# EAGLE design MED_ESP32_C3_0002 (EAGLE 6.5.0)
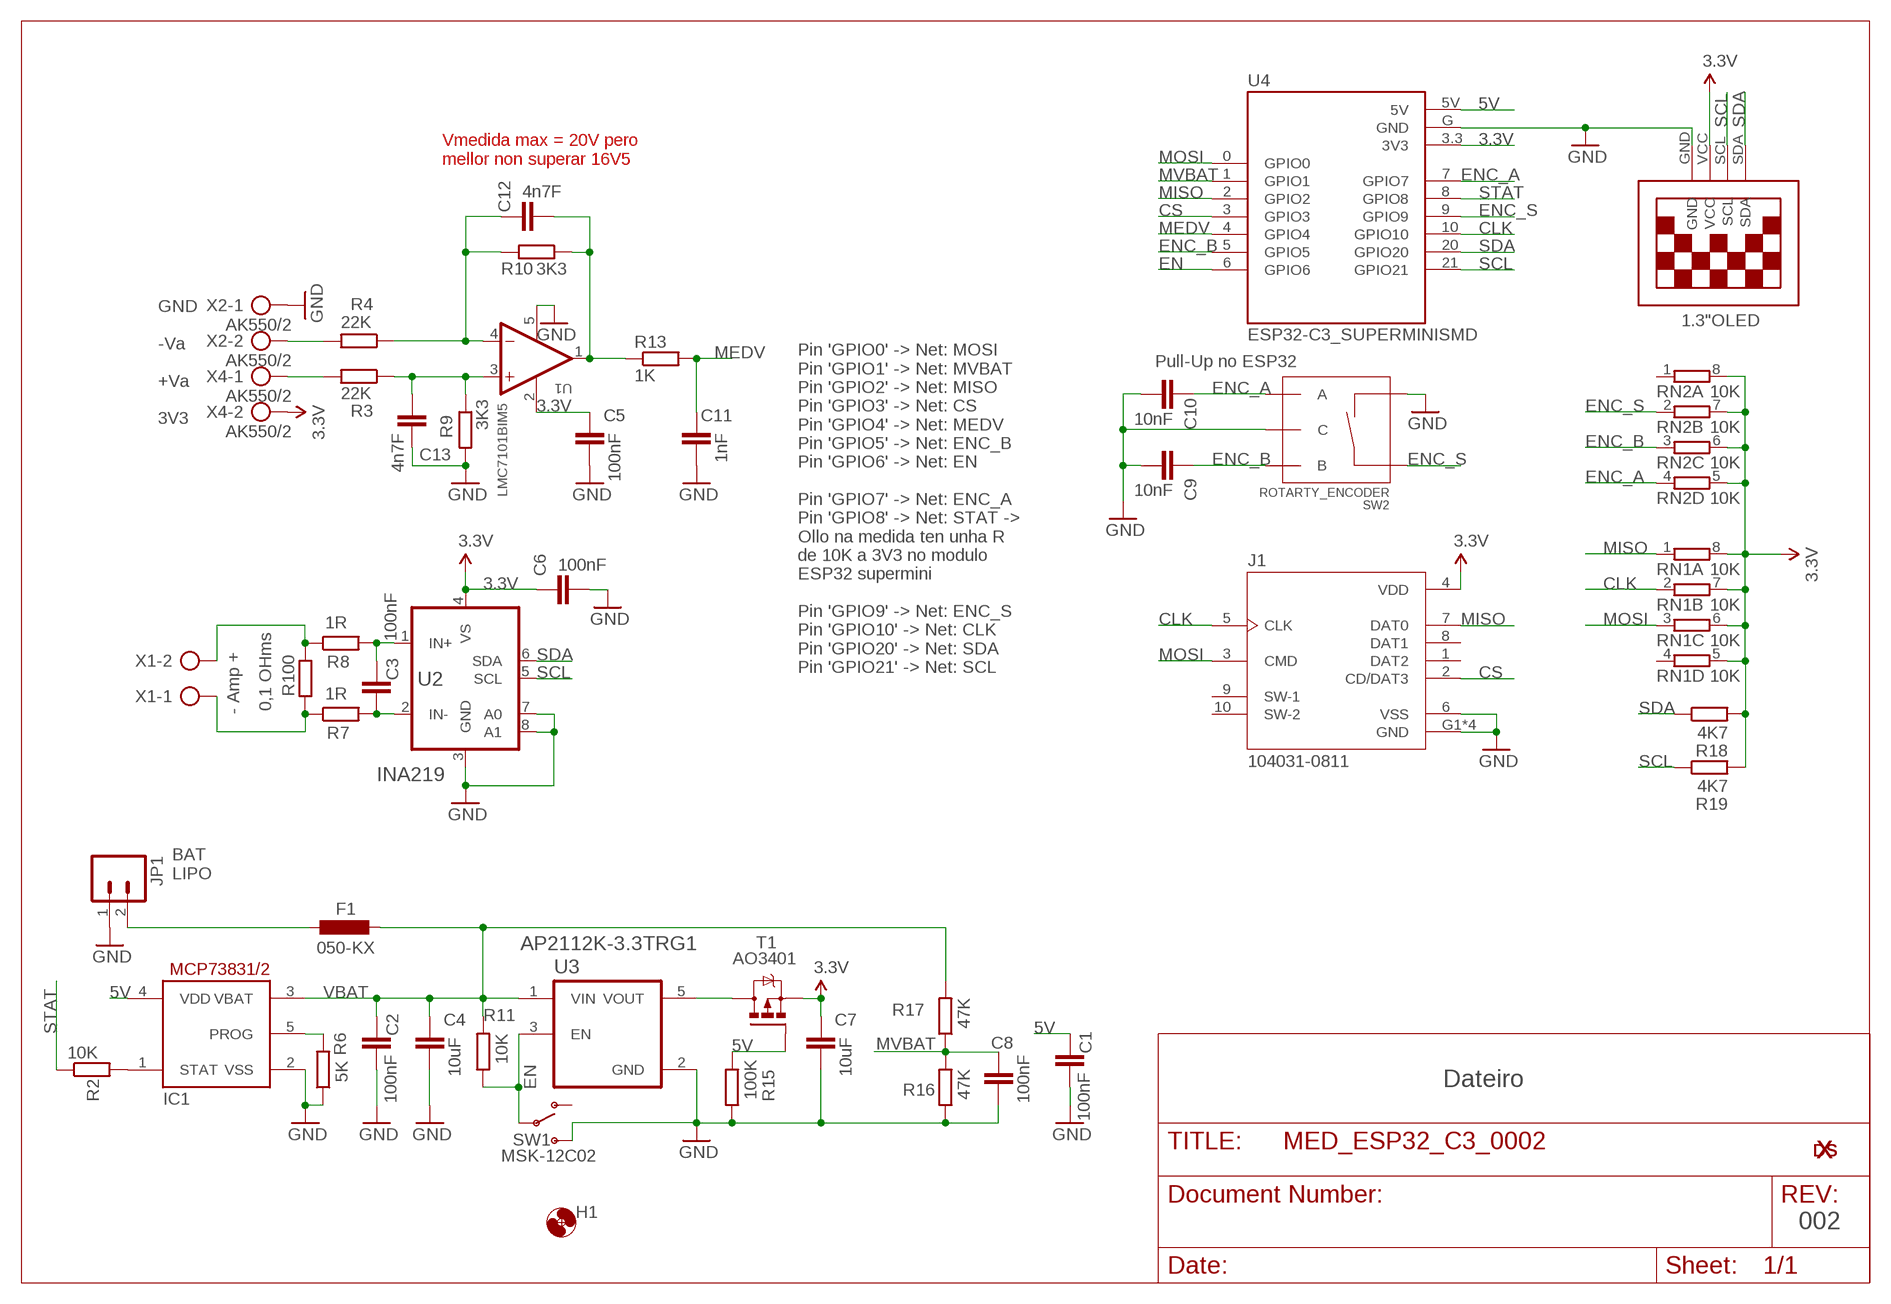
[diagram p0: schematic, sheet 1]

## Parts
C1  100nF  C-EUC0603  [C0603]
C2  100nF  C-EUC0603  [C0603]
C3  100nF  C-EUC0603  [C0603]
C4  10uF  C-EUC1206  [C1206]
C5  100nF  C-EUC0603  [C0603]
C6  100nF  C-EUC0603  [C0603]
C7  10uF  C-EUC1206  [C1206]
C8  100nF  C-EUC0603  [C0603]
C9  10nF  C-EUC0603  [C0603]
C10  10nF  C-EUC0603  [C0603]
C11  1nF  C-EUC0603  [C0603]
C12  4n7F  C-EUC0603  [C0603]
C13  4n7F  C-EUC0603  [C0603]
F1  050-KX  L-EUL3225M  [L3225M]
H1  HOLES_MOUNT-HOLE3.2  [HOLES_3,2]
IC1  MCP73831T-2  MCP73831/OT  [SOT23-5L]
J1  104031-0811  [MOLEX_104031-0811]
JP1  M02JST-PTH-VERT  [JST-2-PTH-VERT]
R2  10K  R-EU_R0603  [R0603]
R3  22K  R-EU_R0603  [R0603]
R4  22K  R-EU_R0603  [R0603]
R5  R100  R-EU_R1210  [R1210]
R6  5K  R-EU_R0603  [R0603]
R7  1R  R-EU_R0603  [R0603]
R8  1R  R-EU_R0603  [R0603]
R9  3K3  R-EU_R0603  [R0603]
R10  3K3  R-EU_R0603  [R0603]
R11  10K  R-EU_R0603  [R0603]
R13  1K  R-EU_R0603  [R0603]
R15  100K  R-EU_R0603  [R0603]
R16  47K  R-EU_R0603  [R0603]
R17  47K  R-EU_R0603  [R0603]
R18  4K7  R-EU_R0603  [R0603]
R19  4K7  R-EU_R0603  [R0603]
RN1  10K  RESISTOR-DIL_4R-N0603-ARC  [RESISTOR-DIL_0603-ARC]
RN2  10K  RESISTOR-DIL_4R-N0603-ARV  [RESISTOR-DIL_0603-ARV]
SW1  MSK-12C02  SWITCH_SPDT  [KPS-1290]
SW2  ROTARTY_ENCODER  [ROTARY_ENC_PLAIN]
T1  AO3401  MOSFET-PCHANNEL  [SOT23]
U1  LMC7101BIM5  [SOT95P280X145-5N]
U2  INA219  [SOT65P280X145-8N]
U3  AP2112K-3.3TRG1  [SOT95P285X140-5N]
U4  ESP32-C3_SUPERMINISMD  [MODULE_ESP-C3_SUPERMINI_SMD]
U$1  13"OLED13"OLED  [1.3"OLED]
U$2  XDESIG5MM  [XDESIG_CU]
U$3  XDESIG21  [XDESIG]
U$4  XDESIG21  [XDESIG]
U$5  XDESIG5MM  [XDESIG_CU]
X1  AK500/2  [AK500/2]
X2  AK550/2  [AK550/2]
X4  AK550/2  [AK550/2]

## Nets
3.3V: C5.2 C6.2 C7.2 J1.4(VDD) R18.2 R19.2 RN1.5 RN1.6 RN1.7 RN1.8 RN2.5 RN2.6 RN2.7 RN2.8 T1.2(S) U1.2(V+) U2.4(VS) U4.3.3(3V3) U$1.VCC X4.2
5V: C1.1 IC1.4(VDD) R15.2 T1.1(G) U4.5V
CLK: J1.5(CLK) RN1.2 U4.10(GPIO10)
CS: J1.2(CD/DAT3) U4.3(GPIO3)
EN: R11.1 SW1.P U3.3(EN) U4.6(GPIO6)
ENC_A: C10.2 RN2.4 SW2.A U4.7(GPIO7)
ENC_B: C9.2 RN2.3 SW2.B U4.5(GPIO5)
ENC_S: RN2.2 SW2.SW+ U4.9(GPIO9)
GND: C1.2 C2.2 C4.1 C5.1 C6.1 C7.1 C8.2 C9.1 C10.1 C11.1 C13.2 IC1.2(VSS) J1.6(VSS) J1.G1(GND) J1.G2(GND) J1.G3(GND) J1.G4(GND) JP1.1 R6.1 R9.2 R15.1 R16.1 SW1.S SW2.C SW2.SW- U1.5(V-) U2.3(GND) U2.7(A0) U2.8(A1) U3.2(GND) U4.G(GND) U$1.GND X2.1
MEDV: C11.2 R13.2 U4.4(GPIO4)
MISO: J1.7(DAT0) RN1.1 U4.2(GPIO2)
MOSI: J1.3(CMD) RN1.3 U4.0(GPIO0)
MVBAT: C8.1 R16.2 R17.1 U4.1(GPIO1)
N$1: R4.2 X2.2
N$2: T1.3(D) U3.5(VOUT)
N$4: C12.2 R4.1 R10.2 U1.4(-IN)
N$5: R3.2 X4.1
N$6: IC1.1(STAT) R2.2
N$7: IC1.5(PROG) R6.2
N$8: C12.1 R10.1 R13.1 U1.1(OUT)
N$9: F1.2 JP1.2
N$29: C13.1 R3.1 R9.1 U1.3(+IN)
N$81: C3.1 R8.2 U2.1(IN+)
N$96: C3.2 R7.2 U2.2(IN-)
N$103: R5.2 R8.1 X1.2
N$105: R5.1 R7.1 X1.1
SCL: R19.1 U2.5(SCL) U4.21(GPIO21) U$1.SCL
SDA: R18.1 U2.6(SDA) U4.20(GPIO20) U$1.SDA
STAT: R2.1 U4.8(GPIO8)
VBAT: C2.1 C4.2 F1.1 IC1.3(VBAT) R11.2 R17.2 U3.1(VIN)
Unconnected: J1.1(DAT2) J1.8(DAT1) J1.9(SW-1) J1.10(SW-2) RN1.4 RN2.1 SW1.O

## Notes on the sheet
- Vmedida max = 20V pero 
  mellor non superar 16V5
- 1.3"OLED
- Pull-Up no ESP32
- GND
  
  -Va
  
  +Va
  
  3V3
- 0,1 OHms
- - Amp +
- Pin 'GPIO0' -> Net: MOSI
  Pin 'GPIO1' -> Net: MVBAT
  Pin 'GPIO2' -> Net: MISO
  Pin 'GPIO3' -> Net: CS
  Pin 'GPIO4' -> Net: MEDV 
  Pin 'GPIO5' -> Net: ENC_B
  Pin 'GPIO6' -> Net: EN 
  
  Pin 'GPIO7' -> Net: ENC_A
  Pin 'GPIO8' -> Net: STAT -> 
  Ollo na medida ten unha R
  de 10K a 3V3 no modulo
  ESP32 supermini
  
  Pin 'GPIO9' -> Net: ENC_S
  Pin 'GPIO10' -> Net: CLK
  Pin 'GPIO20' -> Net: SDA
  Pin 'GPIO21' -> Net: SCL
- BAT
  LIPO
- Dateiro
- 002

## Library data of the parts
C1-C13 = rcl:C-EU: CAPACITOR, European symbol
F1 = rcl:L-EU: INDUCTOR, European symbol
H1 = escorna_LBREscorna_CPU_2_10:HOLES_MOUNT-HOLE: MOUNTING HOLE with drill center marker
IC1 = adafruit:MCP73831: MCP73831/2 Miniature Single-Cell, Fully Integrated Li-Ion, Li-Polymer Charge Management Controllers. Nice and small simple lipoly charge controller, with adjustable current and status output (LED) http://www.ladyada.net/library/pcb/eaglelibrary.html
J1 = 104031-0811:104031-0811: Check availability <https://pricing.snapeda.com/parts/104031-0811/Molex/view-part?ref=eda>; AVAILABILITY: In Stock; CHECK_PRICES: https://www.snapeda.com/parts/104031-0811/Molex/view-part/?ref=eda; DESCRIPTION: Surface Mount Micro SD Card Connector, with Push In Termination | Molex Incorporated 104031-0811; MF: Molex; MP: 104031-0811; PACKAGE: None; PRICE: None; PURCHASE-URL: https://www.snapeda.com/api/url_track_click_mouser/?unipart_id=301764&manufacturer=Molex&part_name=104031-0811&search_term=1040310811; SNAPEDA_LINK: https://www.snapeda.com/parts/104031-0811/Molex/view-part/?ref=snap
JP1 = SparkFun-Connectors:M02: Standard 2-pin 0.1" header. Use with - straight break away headers ( PRT-00116) - right angle break away headers (PRT-00553) - swiss pins (PRT-00743) - machine pins (PRT-00117) - female headers (PRT-00115) Molex polarized connector foot print use with: PRT-08233 with associated crimp pins and housings. 2.54_SCREWTERM for use with PRT-10571. 3.5mm Screw Terminal footprints for PRT-08084 5mm Screw Terminal footprints for use with PRT-08432
R2-R11 R13 R15-R19 = rcl:R-EU_: RESISTOR, European symbol
RN1 RN2 = cervus2.100:RESISTOR-DIL_4R-N: Array Chip Resistor Source: RS Component / Phycomp
SW1 = SparkFun-Electromechanical:SWITCH_SPDT: SWCH-10651 Side-actuated SPDT slide switch, as used on the Arduino Pro; PROD_ID: SWCH-10651
SW2 = SparkFun-Electromechanical:ROTARTY_ENCODER: Simple no LED rotary encoder Example: COM-09117
T1 = SparkFunEagle-6-6-07:MOSFET-PCHANNEL
U1 = LMC7101BIM5:LMC7101BIM5; CHECK_PRICES: https://www.snapeda.com/parts/LMC7101BIM5/NOPB/Texas+Instruments/view-part/?ref=eda; DESCRIPTION: Single, 15.5-V, 1.1-MHz operational amplifier; MF: Texas Instruments; MP: LMC7101BIM5/NOPB; PACKAGE: SOT-23-5 Texas Instruments; PRICE: None; PURCHASE-URL: https://www.snapeda.com/api/url_track_click_mouser/?unipart_id=19250&manufacturer=Texas Instruments&part_name=LMC7101BIM5/NOPB&search_term=None; SNAPEDA_LINK: https://www.snapeda.com/parts/LMC7101BIM5/NOPB/Texas+Instruments/view-part/?ref=snap
U2 = INA219:INA219: Check availability <https://pricing.snapeda.com/parts/INA219AIDCNRG4/Texas%20Instruments/view-part?ref=eda>; AVAILABILITY: In Stock; CHECK_PRICES: https://www.snapeda.com/parts/INA219AIDCNRG4/Texas+Instruments/view-part/?ref=eda; DESCRIPTION: Current Monitor Regulator High-Side 10mA SOT-23-8; MF: Texas Instruments; MP: INA219AIDCNRG4; PACKAGE: SOT-23-8 Texas Instruments; PRICE: None; SNAPEDA_LINK: https://www.snapeda.com/parts/INA219AIDCNRG4/Texas+Instruments/view-part/?ref=snap
U3 = AP2112K:AP2112K-3.3TRG1: AP2112 Series 0.6 A 3.3 V Fixed Output SMT LDO Linear Regulator - SOT23-5; AVAILABILITY: Unavailable; DESCRIPTION: Linear Voltage Regulator IC 1 Output 600mA SOT-25; DIGIKEY-PURCHASE-URL: https://snapeda.com/shop?store=DigiKey&id=454988; MF: Diodes Inc.; MP: AP2112K-3.3TRG1; PACKAGE: SOT-753 Diodes Inc.; PRICE: None
U4 = ESP32-C3_SUPERMINI:ESP32-C3_SUPERMINI: Check availability <https://pricing.snapeda.com/parts/ESP32-C3%20SuperMini/Espressif%20Systems/view-part?ref=eda>
U$1 = 13oled:13"OLED
U$2-U$5 = xdesig:XDESIG
X1 = con-ptr500:AK500/2: CONNECTOR; OC_FARNELL: unknown; OC_NEWARK: unknown
X2 X4 = con-ptr500:AK550/2: CONNECTOR; OC_FARNELL: unknown; OC_NEWARK: unknown

## Board
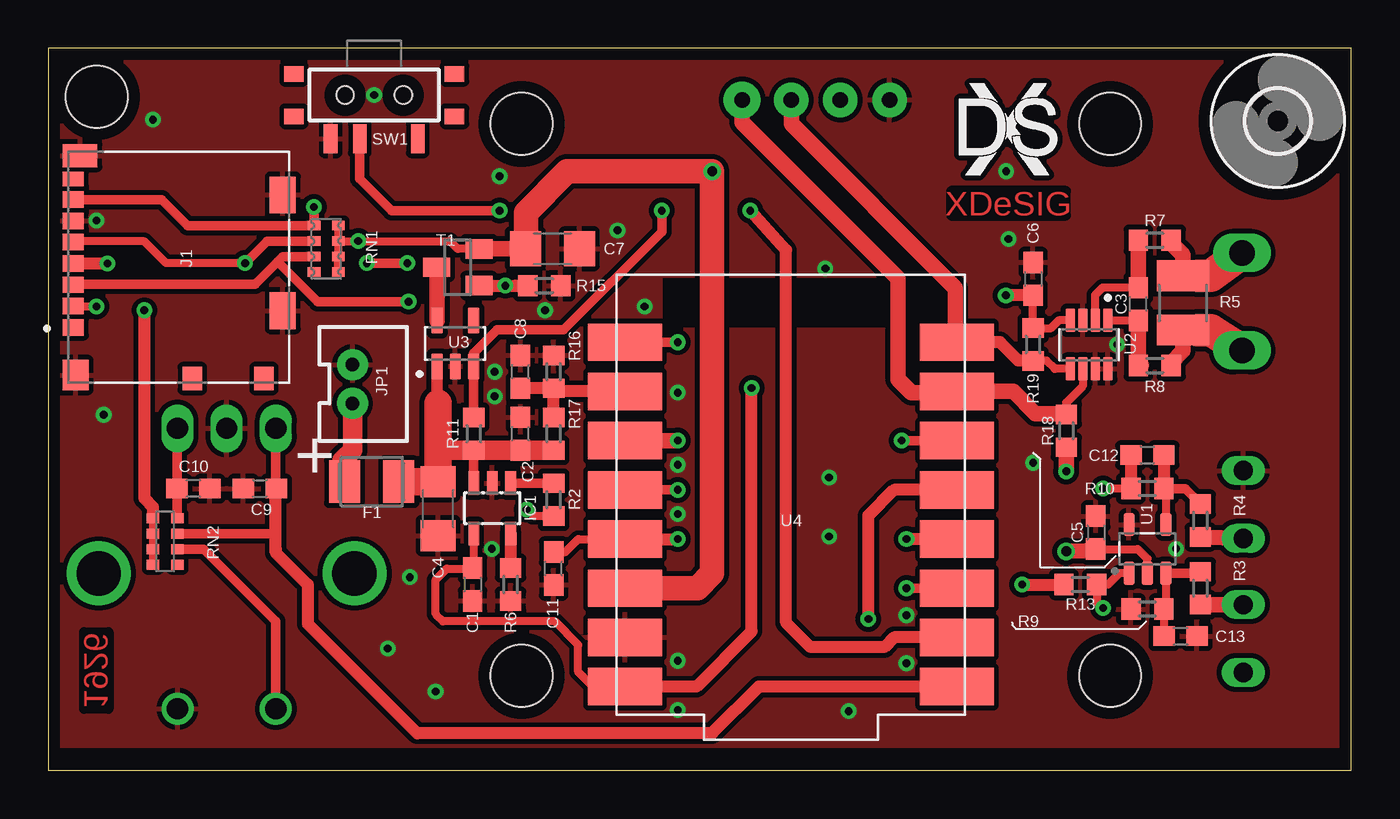
[diagram p1: board, top side]
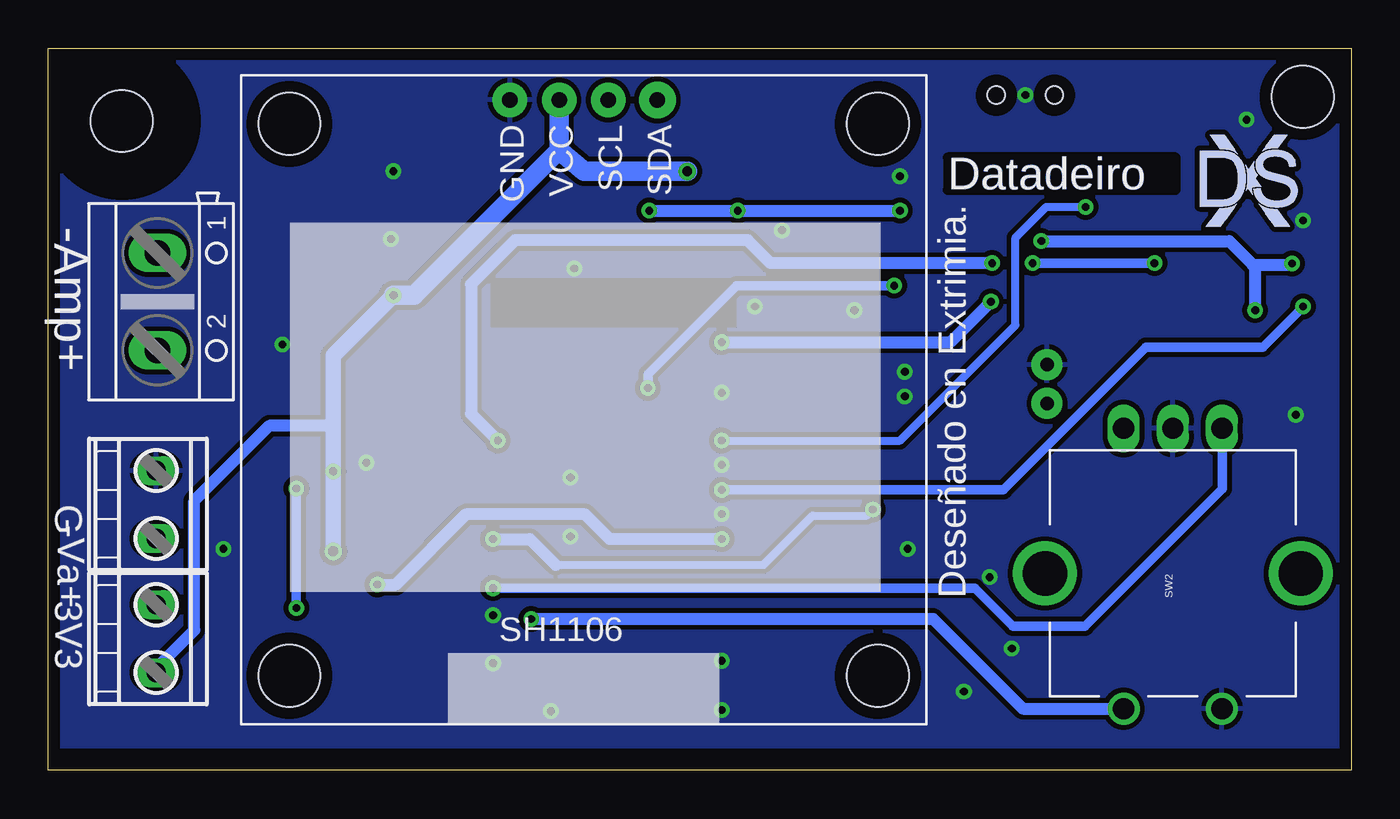
[diagram p2: board, bottom side, seen from below]

Size 67.29 x 37.27 mm. Coordinates in mm from the lower left corner, seen from the top.
Outline: 0,0 67.29,0 67.29,37.27 0,37.27 0,0
Copper layers (1*16): Top 0.035mm / dielectric 1.5mm / Bottom 0.035mm
Design rules "Vias_pintadas *": minimum track width 10mil, minimum drill 0.4mm, track to track 10mil, track to pad 10mil, pad to pad 8mil, via to via 12mil, smd to smd 8mil, copper to edge 24mil, drill to drill 12mil, minimum pad ring 10mil, minimum via ring 8mil, stop-mask expansion 2mil, vias tented up to drill 30mil, thermal gap 10mil
Holes 3.2 mm at 2.5,34.77
tRestrict: area 31.8,22.9 to 44.5,25.4
bRestrict: area 31.8,22.9 to 44.5,25.4

### Footprints (pad centres in the part's own frame; a part is rotated, then mirrored left to right if it is on the bottom)
C0603 = smd 1.1 x 1: 1 -0.85,0; 2 0.85,0
C1206 = smd 1.6 x 1.8: 1 -1.4,0; 2 1.4,0
L3225M = smd 1.6 x 2.2: 1 -1.4,0; 2 1.4,0
HOLES_3,2 = hole 3.2: 0,0
SOT23-5L = smd 0.55 x 1.2: 1 -0.95,-1.3; 2 0,-1.3; 3 0.95,-1.3; 4 0.95,1.3; 5 -0.95,1.3
MOLEX_104031-0811 = smd 0.85 x 1.1: 1 3.105,-5.45; 2 2.005,-5.45; 3 0.905,-5.45; 4 -0.195,-5.45; 5 -1.295,-5.45; 6 -2.395,-5.45; 7 -3.495,-5.45 | smd 0.75 x 1.1: 8 -4.545,-5.45 | smd 1.2 x 1: 9 5.74,0.7; 10 5.74,4.4 | smd 1.55 x 1.35: G1 5.565,-5.325 | smd 1.17 x 1.8: G2 -5.755,-5.1 | smd 1.9 x 1.35: G3 -3.73,5.375; G4 2.24,5.375
JST-2-PTH-VERT = drill 0.7 pad 1.6: 1 -1,-0.55; 2 1,-0.55
R0603 = smd 1 x 1.1: 1 -0.85,0; 2 0.85,0
R1210 = smd 1.6 x 2.7: 1 -1.4,0; 2 1.4,0
RESISTOR-DIL_0603-ARC = smd 0.5 x 0.65: 1 -1.2,-0.625; 2 -0.4,-0.625; 3 0.4,-0.625; 4 1.2,-0.625; 5 1.2,0.625; 6 0.4,0.625; 7 -0.4,0.625; 8 -1.2,0.625
RESISTOR-DIL_0603-ARV = smd 0.5 x 0.65: 1 -1.2,-0.625; 2 -0.4,-0.625; 3 0.4,-0.625; 4 1.2,-0.625; 5 1.2,0.625; 6 0.4,0.625; 7 -0.4,0.625; 8 -1.2,0.625
KPS-1290 = smd 0.7 x 1.5: O -2.25,2.25; P 0.75,2.25; S 2.25,2.25 | smd 1 x 0.8: P$1 -4.15,1.1; P$2 -4.15,-1.1; P$3 4.15,-1.1; P$4 4.15,1.1 | hole 0.9: -1.5,0; 1.5,0
ROTARY_ENC_PLAIN = drill 1.1 long: A 7.493,-2.54; B 7.493,2.54; C 7.493,0 | drill 2.286: P$3 0,6.604; P$4 0,-6.604 | drill 1.1: SW+ -6.985,2.54; SW- -6.985,-2.54
SOT23 = smd 1 x 1.4: 1 -0.95,-1.1; 2 0.95,-1.1; 3 0,1.1
SOT95P280X145-5N = smd 1.21 x 0.59: 1 -1.255,0.95; 2 -1.255,0; 3 -1.255,-0.95; 4 1.255,-0.95; 5 1.255,0.95
SOT65P280X145-8N = smd 1.21 x 0.48: 1 -1.255,0.975; 2 -1.255,0.325; 3 -1.255,-0.325; 4 -1.255,-0.975; 5 1.255,-0.975; 6 1.255,-0.325; 7 1.255,0.325; 8 1.255,0.975
SOT95P285X140-5N = smd 1.35 x 0.6: 1 -1.185,0.95; 2 -1.185,0; 3 -1.185,-0.95; 4 1.185,-0.95; 5 1.185,0.95
MODULE_ESP-C3_SUPERMINI_SMD = smd 3.81 x 1.93: 0 8.572,-9.144; 1 8.572,-6.604; 2 8.572,-4.064; 3 8.572,-1.524; 3.3 8.572,3.556; 4 8.572,1.016; 5 -8.572,8.636; 5V 8.572,8.636; 6 -8.572,6.096; 7 -8.572,3.556; 8 -8.572,1.016; 9 -8.572,-1.524; 10 -8.572,-4.064; 20 -8.572,-6.604; 21 -8.572,-9.144; G 8.572,6.096
1.3"OLED = drill 0.8 pad 1.778: GND 13.89,-1.27; SCL 18.97,-1.27; VCC 16.43,-1.27 | drill 0.8 pad 1.9: SDA 21.51,-1.27 | hole 3.2: 2.5,-2.5; 32.9,-2.5; 2.5,-31; 32.9,-31
AK500/2 = drill 1.321 long: 1 -2.515,0; 2 2.515,0
AK550/2 = drill 1 pad 1.5 long: 1 -1.75,0; 2 1.75,0

### Placement (x,y rotation side)
C1  21.91,9.59 270 top
C2  24.38,17.37 90 top
C3  56.3,24.07 90 top
C4  20.13,13.51 90 top
C5  54.1,12.27 270 top
C6  50.86,25.37 270 top
C7  26.04,26.92 180 top
C8  24.38,20.57 90 top
C9  10.92,14.54 0 top
C10  7.49,14.54 180 top
C11  26.1,10.41 90 top
C12  56.77,16.27 0 top
C13  58.48,6.92 0 top
F1  16.7,14.9 180 top
H1  63.5,33.52 0 top
IC1  22.92,13.53 180 top
J1  6.73,25.97 270 top
JP1  16.26,19.94 270 top
R2  26.1,13.97 90 top
R3  59.5,9.4 270 top
R4  59.5,12.89 270 top
R5  58.6,24.13 270 top
R6  23.88,9.59 90 top
R7  57.15,27.37 180 top
R8  57.15,20.89 180 top
R9  56.77,8.32 180 top
R10  56.77,14.54 0 top
R11  21.97,17.37 270 top
R13  53.3,9.59 180 top
R15  25.61,25.02 180 top
R16  26.1,20.57 270 top
R17  26.1,17.37 270 top
R18  52.58,17.53 270 top
R19  50.86,21.98 90 top
RN1  14.35,26.92 270 top
RN2  6.03,11.81 90 top
SW1  16.83,34.86 180 top
SW2  9.21,10.16 90 bottom
T1  21.15,25.97 90 top
U1  56.77,11.43 90 top
U2  53.75,21.98 270 top
U3  21.02,22.03 90 top
U4  38.35,12.95 180 top
U$1  57.34,35.88 0 bottom
U$2  47.05,30.73 0 top
U$3  47.05,30.73 0 top
U$4  7.81,28.07 0 bottom
U$5  7.81,28.07 0 bottom
X1  61.66,24.19 270 bottom
X2  61.72,13.72 270 bottom
X4  61.72,6.79 270 bottom

### Tracks (layer width: path | path; a pad name or v marks a point on that pad's centre or on a via)
3.3V  (via drill 0.4, 0.4 pad 0.41, 0.5)
  Top 0.406: RN2.8 RN2.7 RN2.6 RN2.5 | U1.2 56.77,10.92 56.27,11.42 C5.2 | C5.2 54.1,11.32 | 54.14,11.18 C5.2 | RN1.8 RN1.7 | RN1.5 RN1.6 RN1.7 | T1.2 21.14,26.92 20.75,27.32 v16,27.32 RN1.7 | 50.96,22.92 R19.2 | R19.2 C6.2 | U2.4 52.19,23.23 51.75,22.8 50.9,22.8 R19.2
  Top 0.61: v4.95,23.75 4.95,14.03 5.4,13.59 5.4,13.02 RN2.5 | 29.76,9.37 U4.3.3 | v3.05,26.16 1.16,26.16 J1.4 | C6.2 v49.46,24.52
  Top 0.813: C7.2 T1.2 | 54.1,11.32 53.61,11.32 v52.58,11.3 | R18.2 v52.58,15.43
  Top 1.016: 24.66,26.95 C7.2
  Top 1.27: U4.3.3 33.53,9.4 34.29,10.16 v34.29,30.92 26.8,30.92 24.66,28.79 24.66,26.95
  Bottom 0.61: 5.08,26.1 3.11,26.1 v3.05,26.16 | v4.95,23.75 4.95,25.97 5.08,26.1 | 5.08,26.1 6,27.02 6.16,27.18 6.3,27.32 v16,27.32 | 52.58,17.78 55.88,17.78 59.75,13.91 59.75,7.24 61.72,5.27 X4.2
  Bottom 0.813: v52.58,11.3 v52.58,15.43 52.58,17.78 52.58,21.4 v49.46,24.52
  Bottom 1.016: 40.91,32.02 39.62,30.92 v34.29,30.92 | 40.91,32.02 U$1.VCC | 40.91,32.02 48.41,24.52 v49.46,24.52
5V  (via drill 0.4)
  Top 0.406: U4.5V 28.13,4.32 27.37,5.08 27.37,6.48 26.16,7.68 20.38,7.68 20,8.06 20,9.84 20.57,10.41 21.88,10.41 C1.1 21.97,10.5 IC1.4
  Top 0.5: T1.1 23.24,25.02 v23.6,25.02 | 29.84,4.38 U4.5V
  Top 0.61: T1.1 24.12,25.02 R15.2 | v36.32,19.73 36.32,7.18 33.47,4.32 U4.5V
  Bottom 0.5: v23.6,25.02 31.75,25.02 36.32,20.45 v36.32,19.73
CLK  (via drill 0.4)
  Top 0.406: 1.16,27.26 J1.5 | 1.21,27.32 J1.5 | v10.16,26.18 6.08,26.18 4.95,27.3 1.19,27.3 J1.5
  Top 0.5: U4.10 v44.07,17.02 | v18.54,26.18 v16.45,26.18 | RN1.2 11.3,27.32 v10.16,26.18
  Bottom 0.5: v16.45,26.18 v10.16,26.18
  Bottom 0.61: v18.54,26.18 29.99,26.18 31.18,27.37 43.18,27.37 45.47,25.08 45.47,18.41 v44.07,17.02
CS  (via drill 0.4)
  Top 0.406: v2.48,23.94 1.18,23.94 J1.2
  Top 0.5: U4.3 v32.51,14.48
  Bottom 0.5: v32.51,14.48 17.97,14.48 10.6,21.84 4.57,21.84 v2.48,23.94
EN  (via drill 0.4)
  Top 0.406: U3.3 21.97,21.14
  Top 0.5: SW1.P 16.08,30.53 17.72,28.89 v23.3,28.89 | U3.3 21.97,18.26 R11.1 | 21.97,21.14 21.97,21.52 23.18,22.73 26.61,22.73 31.69,27.81 v31.69,28.89
  Top 0.61: U4.6 43.69,6.86 43.18,6.35 39.37,6.35 38.1,7.62 38.1,26.86 v36.26,28.89
  Bottom 0.61: v23.3,28.89 v31.69,28.89 v36.26,28.89
ENC_A  (via drill 0.4)
  Top 0.5: SW2.A 6.64,17.63 C10.2 6.66,14.53 RN2.4 | U4.7 v44.32,9.4
  Bottom 0.5: v44.32,9.4 19.43,9.4 17.46,7.43 13.76,7.43 C10.2 6.64,17.63 SW2.A
ENC_B
  Top 0.406: 11.77,12.21 11.77,11.45 11.75,11.43
  Top 0.5: RN2.3 11.77,12.21 | SW2.B 11.75,14.57 C9.2 11.77,13.49
  Top 0.61: U4.5 36.7,4.32 34.29,1.91 19.05,1.91 13.4,7.56 13.4,9.59 11.75,11.24 11.75,11.43 11.75,14.52 C9.2
ENC_S  (via drill 0.4)
  Top 0.5: RN2.2 8.02,11.41 11.75,7.68 SW2.SW+
  Top 0.61: v42.35,7.81 42.35,13.14 43.69,14.48 U4.9
  Bottom 0.61: v42.35,7.81 21.59,7.81 16.95,3.17 SW2.SW+
GND  (via drill 0.4)
  other vias: 58.25,11.43 55.2,21.98 18.67,9.97 44.32,8 20,4.06 23.3,30.67 32.51,3.11 22.9,11.43 23.05,20.57 25.65,23.75 23.05,19.3 29.4,27.88 32.51,19.49 30.8,23.94 32.51,5.65 41.34,3.05 40.32,15.11 44.32,5.52 40.13,25.91 50.86,15.88 49.47,30.92 49.59,27.43 32.51,15.77 17.53,6.29 16.83,34.86 2.48,28.38 5.4,33.59 2.86,18.35 40.32,12.07 32.51,13.23
  pour Top: 0,1.27 0.13,37.47 67.44,37.47 67.31,1.27
  pour Bottom: 0,1.27 0,37.59 67.31,37.59 67.31,1.27
MEDV  (via drill 0.4)
  Top 0.406: C11.2 26.7,11.26 27.37,11.94 U4.4
  Top 0.61: U4.4 v32.51,11.94 | v50.29,9.59 R13.2
  Bottom 0.61: v32.51,11.94 38.29,11.94 39.56,13.21 45.72,13.21 49.34,9.59 v50.29,9.59
MISO  (via drill 0.4)
  Top 0.406: 1.16,29.46 J1.7
  Top 0.5: 1.16,29.46 5.84,29.46 7.18,28.12 RN1.1 v13.73,29.07 v13.72,29.08
  Top 0.813: U4.2 v32.51,17.02
  Bottom 0.406: v13.72,29.08 15.75,29.08 17.34,27.5 17.34,22.99 23.3,17.02 v32.51,17.02
MOSI  (via drill 0.4)
  Top 0.406: 1.17,25.08 J1.3
  Top 0.5: U4.0 v32.51,22.1 | RN1.3 12.11,26.52 11.84,26.26 | 1.17,25.08 10.67,25.08 11.84,26.26 | v18.61,24.19 13.91,24.19 11.84,26.26
  Bottom 0.61: v32.51,22.1 20.7,22.1 v18.61,24.19
MVBAT
  Top 0.61: R17.1 R16.2 | U4.1 26.12,19.56 R16.2 | R16.2 C8.1
N$1
  Top 0.813: X2.2 59.51,12.03 R4.2
N$2
  Top 0.5: 20.07,25.95 T1.3
  Top 0.813: U3.5 20.07,25.95
N$4
  Top 0.406: U1.4 57.73,12.7 57.73,14.43 R10.2
  Top 0.5: R4.1 59.5,13.78 58.74,14.54 R10.2
  Top 0.61: C12.2 R10.2
N$5
  Top 0.813: X4.1 R3.2
N$6
  Top 0.5: R2.2 IC1.1
N$7
  Top 0.61: IC1.5 R6.2
N$8  (via drill 0.4)
  Top 0.406: R10.1 v54.48,14.54 | U1.1 55.32,10.17 54.74,9.59 R13.1 54.15,8.7 v54.48,8.37
  Top 0.61: C12.1 R10.1
  Bottom 0.5: v54.48,14.54 v54.48,8.37
N$9
  Top 1.016: JP1.2 15.71,16.53 15.18,16 15.18,14.92 F1.2
N$29
  Top 0.406: 57.73,10.16 U1.3 57.72,8.42 R9.1 57.62,6.94 C13.1
  Top 0.5: U1.3 59.43,10.17 R3.1
N$81
  Top 0.406: U2.1 56.43,23.23 C3.1
  Top 0.813: 56.45,20.91 R8.2 C3.1
N$96
  Top 0.406: C3.2 54.44,24.92 54.08,24.55 U2.2
  Top 0.813: C3.2 R7.2
N$103
  Top 0.813: R8.1 58,21.04 58.61,21.65 R5.2 59.37,22.73
  Top 1.676: 59.37,22.73 60.04,22.73 X1.2
N$105
  Top 0.813: R7.1 58,27.22 58.61,26.61 R5.1 59.37,25.53
  Top 1.676: 59.37,25.53 60.04,25.53 X1.1
SCL
  Top 0.406: U2.5 51.98,20.72 51.56,21.14 50.88,21.14 R19.1
  Top 0.61: R19.1 50.85,21.14 50.1,21.14 49.15,22.1 U4.21
  Top 0.813: U$1.SCL 38.37,33.38 46.86,24.89 46.86,22.16 U4.21
SDA
  Top 0.406: U2.6 53.43,19.84 52.58,18.99 R18.1
  Top 0.813: U$1.SDA 35.83,33.45 43.88,25.4 43.88,20.19 44.58,19.49 46.86,19.49 U4.20 49.85,19.56 50.99,18.41 52.54,18.41 R18.1
STAT  (via drill 0.4)
  Top 0.406: v24.7,13.46 25.02,13.14 26.07,13.14 R2.1
  Top 0.5: 26.04,13.06 R2.1
  Top 0.61: U4.8 v44.32,11.94
  Bottom 0.406: 41.08,10.61 30.35,10.61 27.81,13.14 25.02,13.14 v24.7,13.46
  Bottom 0.61: v44.32,11.94 42.42,11.94 41.08,10.61
VBAT
  Top 0.5: 20.07,18.94 20.13,18.94 | IC1.3 R11.2
  Top 0.6: U3.1 20.07,18.94
  Top 1.016: 20.13,16.51 R11.2 C2.1 R17.2
  Top 1.422: 20.13,18.94 20.13,16.51 C4.2 F1.1

### Text on the board
Top: XDeSIG | 1926
Bottom: Datadeiro
tPlace: +
bPlace: Datadeiro | Deseñado en Extrimia. | -Amp+ | -Va+ | G 3V3